# Altium schematic sheet PWR_SUPPLY.SchDoc
size A4; SheetNumber: 3; SheetTotal: 6
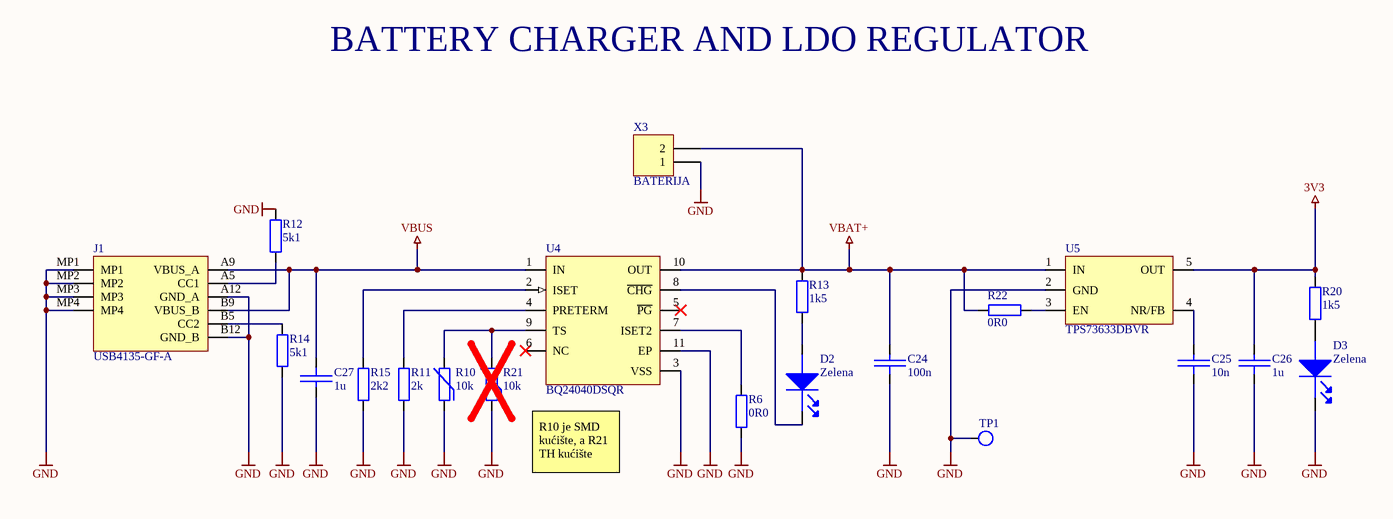
[diagram p0: PWR_SUPPLY.SchDoc]

## Parts
C24  100n  [0805]
C25  10n  [0805]
C26  1u  [0603]
C27  1u  [0603]
D2  Zelena  [0805]
D3  Zelena  [0805]
J1  USB4135-GF-A  [USB4135GFA]
R6  0R0  [0603]
R10  10k  [0402]
R11  2k  [0805]
R12  5k1  [0603]
R13  1k5  [0805]
R14  5k1  [0603]
R15  2k2  [0805]
R20  1k5  [0805]
R21  10k  [TH NTC]
R22  0R0  [0603]
TP1  TEST_POINT  [TST_POINT]  (value not drawn)  (no BOM)
U4  BQ24040DSQR  [WSON-10]
U5  TPS73633DBVR  [SOT23 5pin]
X3  BATERIJA  [BATTERY]  (no BOM)

## Nets
3V3: C26.2 R20.2 U5.5(OUT)
GND: C24.1 C25.1 C26.1 C27.2 D3.1(Cathode) J1.A12(GND_A) J1.B12(GND_B) J1.MP1 J1.MP2 J1.MP3 J1.MP4 R6.1 R10.1 R11.1 R12.2 R14.1 R15.1 R21.1 TP1.1 U4.3(VSS) U4.11(EP) U5.2(GND) X3.1
VBAT+: C24.2 R13.1 R22.2 U4.10(OUT) U5.1(IN) X3.2
VBUS: C27.1 J1.A9(VBUS_A) J1.B9(VBUS_B) U4.1(IN)
NetC25_2: C25.2 U5.4(NR/FB)
NetD2_1: D2.1(Cathode) U4.8(~{CHG})
NetD2_2: D2.2(Anode) R13.2
NetD3_2: D3.2(Anode) R20.1
NetJ1_A5: J1.A5(CC1) R12.1
NetJ1_B5: J1.B5(CC2) R14.2
NetR6_2: R6.2 U4.7(ISET2)
NetR10_2: R10.2 R21.2 U4.9(TS)
NetR11_2: R11.2 U4.4(PRETERM)
NetR15_2: R15.2 U4.2(ISET)
NetR22_1: R22.1 U5.3(EN)

Not connected (* = marked no-connect by the designer): U4 5(~{PG})* 6(NC)*

## Notes on the sheet
- BATTERY CHARGER AND LDO REGULATOR
- R10 je SMD kućište, a R21 TH kućište

## Library data of the parts
C24 = MCJCU21GBB7104KTPA01: Kondenzator, X7R, 10%, 50VDC; Manufacturer: TDK; Manufacturer Part Number: C2012X7R1H104K125AE; Capacitance: 100nF; Value: 100nF; Supplier 1: Mouser; Case/Package: 0805; ComponentLink1Description: https://datasheet.ciiva.com/29534/mlcc-commercial-soft-en-29534235.pdf?src-supplier=Digi-Key; Supplier Part Number 1: 963-MCJCU21GBB7104KT; Category: Ceramic Capacitors; Supplier 2: Mouser; Supplier Part Number 2: 810-C2012X7R1H104KAE; Kučište: 0805
C25 = C0805C103K5RECAUTO: Kondenzator, C0G, 10%, 50VDC; Manufacturer: KEMET; Capacitance: 10nF; Value: 10nF; Supplier 1: Mouser; Manufacturer Part Number: C0805C103K5RECAUTO; Case/Package: 0805; ComponentLink1Description: http://www.farnell.com/datasheets/2723804.pdf?src-supplier=Farnell; Supplier Part Number 1: 80-C0805C103K5RECAUT; Category: Ceramic Capacitors; Kučište: 0805
C26 C27 = C1608X7R1H105K080AB: Kondenzator, X7R, 10%, 50VDC; Manufacturer: TDK; Value: 1µF; Dielectric Material: Ceramic; Voltage Rating (DC): 50V; Supplier: DigiKey; Supplier Part Number: 445-C1608X7R1H105K080ABCT-ND; Manufacturer Part Number: C1608X7R1H105K080AB; Category: Ceramic Capacitors; Stock: 9450; Pricing: 1=0.21, 10=0.121, 50=0.0866, 100=0.076, 500=0.05824, 1000=0.05277 (USD); Height: 800µm; Length: 1.6mm; Lifecycle Status: Production; Max Operating Temperature: 125°C; Min Operating Temperature: -55°C; Mounting Technology: Surface Mount; Number of Terminals: 2; Width: 800µm; ComponentLink1URL: https://datasheet.octopart.com:443/C1608X7R1H105K080AB-TDK-datasheet-175423548.pdf?src-supplier=IHS; ComponentLink1Description: https://datasheet.octopart.com:443/C1608X7R1H105K080AB-TDK-datasheet-175423548.pdf?src-supplier=IHS; Kučište: 0603; Case/Package: 0603
D2 D3 = SM0805GCL: Dioda, svjetleća, 1,9V; Manufacturer: Bivar; Supplier 1: Mouser; Manufacturer Part Number: SM0805GCL; Category: LEDs; Case/Package: 0805; ComponentLink1Description: https://datasheet.ciiva.com/16487/sm0805gcl-16487554.pdf?src-supplier=Future+Electronics; Supplier Part Number 1: 749-SM0805GCL; Kučište: 0805
J1 = USB4135-GF-A: USB-C priključak; Manufacturer_Name: GCT (GLOBAL CONNECTOR TECHNOLOGY); Geometry.Height: 3.5mm; Manufacturer_Part_Number: USB4135-GF-A; Mouser Part Number: 640-USB4135-GF-A; Mouser Price/Stock: https://www.mouser.co.uk/ProductDetail/GCT/USB4135-GF-A?qs=Li%252BoUPsLEnt6HRo6RUvaXA%3D%3D; Arrow Part Number: *; Arrow Price/Stock: *; Datasheet Link: https://ar.mouser.com/datasheet/2/837/usb4135-2930399.pdf; Supplier 1: Farnell; Supplier Part Number 1: 3946920; Case/Package: SMD-10, 11,14x6,78mm
R6 R22 = CRCW06030000Z0EA: Otpornik, 1%, 100mW; Kučište: 0402; Supplier 1: Farnell; Supplier Part Number 1: MCMR04X000 PTL
  R6: Case/Package: 0402
  R22: Case/Package: 0603
R10 = NTCG103JF103FT1: NTC Termistor, 1%; Kučište: 0402; Supplier 1: Farnell; Supplier Part Number 1: NTCG103JF103FT1S; Case/Package: 0402
R11 = RC0805FR-102KL: Otpornik, 1%, 125mW; Manufacturer: Yageo; Supplier 1: Mouser; Manufacturer Part Number: RC0805FR-102KL; Supplier Part Number 1: 603-RC0805FR-102KL; Category: Resistors; Kučište: 0805; Case/Package: 0805
R12 R14 = MCT06030C5101FPW00: Otpornik, ±100ppm/C, 100mW; Manufacturer: Yageo Group; Manufacturer Part Number: AC0603FR-075K1L; Value: 5.1kΩ; Temperature Coefficient: 100ppm/°C; Tolerance: 1%; Voltage Rating: 75V; Supplier: RS; Supplier Part Number: 1978087; RoHS: Compliant; Category: Chip SMD Resistors; Stock: 3500; Pricing: 500=0.005, 2500=0.005, 5000=0.004, 7500=0.004, 10000=0.004 (GBP); Case/Package: 0603; Case Code (Imperial): 0603; Case Code (Metric): 1608; China RoHS: Non-Compliant; Composition: Thick Film; Features: Automotive AEC-Q200, Moisture Resistant; Height: 450µm; Length: 1.6mm; Lifecycle Status: Production; Max Operating Temperature: 155°C; Max Power Dissipation: 100mW; Min Operating Temperature: -55°C; Mounting Technology: Surface Mount; Number of Terminals: 2; Number of Terminations: 2; Packaging: Tape & Reel; Power Dissipation: 100mW; Power Rating: 100mW; REACH SVHC: Yes; Schedule B: 8533210045, 8533210045|8533210045|8533210045|8533210045|8533210045|8533210045|8533210045|8533210045|8533210045|8533210045|8533210045|8533210045|8533210045|8533210045|8533210045|8533210045|8533210045|8533210045|8533210045|8533210045|8533210045|8533210045|8533210045|85; Termination: SMD/SMT; Weight: 2.012816mg; Width: 800µm; Working Voltage: 75V; ComponentLink1URL: https://datasheet.octopart.com:443/AC0603FR-075K1L-Yageo-datasheet-182189377.pdf?src-supplier=IHS; ComponentLink1Description: https://datasheet.octopart.com:443/AC0603FR-075K1L-Yageo-datasheet-182189377.pdf?src-supplier=IHS; ComponentLink2URL: https://datasheet.octopart.com:443/AC0603FR-075K1L-Yageo-datasheet-86786639.pdf?src-supplier=Upverter; ComponentLink2Description: https://datasheet.octopart.com:443/AC0603FR-075K1L-Yageo-datasheet-86786639.pdf?src-supplier=Upverter; ComponentLink3URL: https://datasheet.octopart.com:443/AC0603FR-075K1L-Yageo-datasheet-178509465.pdf?src-supplier=Newark; ComponentLink3Description: https://datasheet.octopart.com:443/AC0603FR-075K1L-Yageo-datasheet-178509465.pdf?src-supplier=Newark; ComponentLink4URL: https://datasheet.octopart.com:443/AC0603FR-075K1L-Yageo-datasheet-151884373.pdf?src-supplier=Future+Electronics; ComponentLink4Description: https://datasheet.octopart.com:443/AC0603FR-075K1L-Yageo-datasheet-151884373.pdf?src-supplier=Future+Electronics; ComponentLink5URL: https://datasheet.octopart.com:443/AC0603FR-075K1L-Yageo-datasheet-166720450.pdf?src-supplier=Future+Electronics; ComponentLink5Description: https://datasheet.octopart.com:443/AC0603FR-075K1L-Yageo-datasheet-166720450.pdf?src-supplier=Future+Electronics; ComponentLink6URL: https://datasheet.octopart.com:443/AC0603FR-075K1L-Yageo-datasheet-137699919.pdf?src-supplier=Future+Electronics; ComponentLink6Description: https://datasheet.octopart.com:443/AC0603FR-075K1L-Yageo-datasheet-137699919.pdf?src-supplier=Future+Electronics; ComponentLink7URL: https://datasheet.octopart.com:443/AC0603FR-075K1L-Yageo-datasheet-128679721.pdf?src-supplier=X-ON; ComponentLink7Description: https://datasheet.octopart.com:443/AC0603FR-075K1L-Yageo-datasheet-128679721.pdf?src-supplier=X-ON; ComponentLink8URL: https://datasheet.octopart.com/AC0603FR-075K1L-Yageo-datasheet-12512238.pdf; ComponentLink8Description: https://datasheet.octopart.com/AC0603FR-075K1L-Yageo-datasheet-12512238.pdf; ComponentLink9URL: https://datasheet.octopart.com:443/AC0603FR-075K1L-Yageo-Group-datasheet-190301926.pdf?src-supplier=element14+APAC; ComponentLink9Description: https://datasheet.octopart.com:443/AC0603FR-075K1L-Yageo-Group-datasheet-190301926.pdf?src-supplier=element14+APAC; ComponentLink10URL: http://sigma.octopart.com:80/conflict_mineral_statement/Yageo-company-3.pdf?src-supplier=Compliance+Statements; ComponentLink10Description: http://sigma.octopart.com:80/conflict_mineral_statement/Yageo-company-3.pdf?src-supplier=Compliance+Statements; ComponentLink11URL: http://sigma.octopart.com:80/rohs_statement/Yageo-company-2.pdf?src-supplier=Compliance+Statements; ComponentLink11Description: http://sigma.octopart.com:80/rohs_statement/Yageo-company-2.pdf?src-supplier=Compliance+Statements; Supplier 1: RS; Supplier Part Number 1: 1978087; Kučište: 0603
R13 R20 = MCU08050C1501FP5: Otpornik, ±50ppm/C, 100mW; ComponentLink5URL: https://datasheet.octopart.com:443/CRCW12061K50JNEA-Vishay-datasheet-21226360.pdf?src-supplier=Newark; ComponentLink5Description: https://datasheet.octopart.com:443/CRCW12061K50JNEA-Vishay-datasheet-21226360.pdf?src-supplier=Newark; ComponentLink8URL: https://datasheet.octopart.com:443/CRCW12061K50JNEA-Vishay-datasheet-24897302.pdf?src-supplier=Farnell; ComponentLink8Description: https://datasheet.octopart.com:443/CRCW12061K50JNEA-Vishay-datasheet-24897302.pdf?src-supplier=Farnell; ComponentLink9URL: https://datasheet.octopart.com:443/CRCW12061K50JNEA-Vishay-datasheet-62316122.pdf?src-supplier=Future+Electronics; ComponentLink9Description: https://datasheet.octopart.com:443/CRCW12061K50JNEA-Vishay-datasheet-62316122.pdf?src-supplier=Future+Electronics; ComponentLink10URL: https://datasheet.octopart.com:443/CRCW12061K50JNEA-Vishay-datasheet-5300368.pdf?src-supplier=Future+Electronics; ComponentLink10Description: https://datasheet.octopart.com:443/CRCW12061K50JNEA-Vishay-datasheet-5300368.pdf?src-supplier=Future+Electronics; ComponentLink11URL: https://datasheet.octopart.com:443/CRCW12061K50JNEA-Vishay-datasheet-137115460.pdf?src-supplier=X-ON; ComponentLink11Description: https://datasheet.octopart.com:443/CRCW12061K50JNEA-Vishay-datasheet-137115460.pdf?src-supplier=X-ON; ComponentLink12URL: https://datasheet.octopart.com:443/CRCW12061K50JNEA-Vishay-Dale-datasheet-47688880.pdf?src-supplier=RS+(Formerly+Allied+Electronics); ComponentLink12Description: https://datasheet.octopart.com:443/CRCW12061K50JNEA-Vishay-Dale-datasheet-47688880.pdf?src-supplier=RS+(Formerly+Allied+Electronics); ComponentLink13URL: https://datasheet.octopart.com:443/CRCW12061K50JNEA-Vishay-datasheet-12001583.pdf?src-supplier=RS+(Formerly+Allied+Electronics); ComponentLink13Description: https://datasheet.octopart.com:443/CRCW12061K50JNEA-Vishay-datasheet-12001583.pdf?src-supplier=RS+(Formerly+Allied+Electronics); ComponentLink14URL: https://datasheet.octopart.com:443/CRCW12061K50JNEA-Vishay-datasheet-5306405.pdf?src-supplier=RS+(Formerly+Allied+Electronics); ComponentLink14Description: https://datasheet.octopart.com:443/CRCW12061K50JNEA-Vishay-datasheet-5306405.pdf?src-supplier=RS+(Formerly+Allied+Electronics); ComponentLink15URL: https://datasheet.octopart.com:443/CRCW12061K50JNEA-Vishay-datasheet-11540273.pdf?src-supplier=Arrow+Electronics; ComponentLink15Description: https://datasheet.octopart.com:443/CRCW12061K50JNEA-Vishay-datasheet-11540273.pdf?src-supplier=Arrow+Electronics; ComponentLink16URL: https://datasheet.octopart.com:443/CRCW12061K50JNEA-Vishay-datasheet-8445837.pdf?src-supplier=element14; ComponentLink16Description: https://datasheet.octopart.com:443/CRCW12061K50JNEA-Vishay-datasheet-8445837.pdf?src-supplier=element14; ComponentLink17URL: https://datasheet.octopart.com:443/CRCW12061K50JNEA-Vishay-datasheet-5377184.pdf?src-supplier=Garrett; ComponentLink17Description: https://datasheet.octopart.com:443/CRCW12061K50JNEA-Vishay-datasheet-5377184.pdf?src-supplier=Garrett; ComponentLink18URL: https://datasheet.octopart.com:443/CRCW12061K50JNEA-Vishay-datasheet-148188.pdf?src-supplier=Garrett; ComponentLink18Description: https://datasheet.octopart.com:443/CRCW12061K50JNEA-Vishay-datasheet-148188.pdf?src-supplier=Garrett; ComponentLink19URL: https://datasheet.octopart.com:443/CRCW12061K50JNEA-Vishay-datasheet-41916.pdf?src-supplier=Garrett; ComponentLink19Description: https://datasheet.octopart.com:443/CRCW12061K50JNEA-Vishay-datasheet-41916.pdf?src-supplier=Garrett; ComponentLink20URL: http://sigma.octopart.com:80/rohs_statement/Vishay-company-15.pdf?src-supplier=Compliance+Statements; ComponentLink20Description: http://sigma.octopart.com:80/rohs_statement/Vishay-company-15.pdf?src-supplier=Compliance+Statements; Supplier 1: Farnell; Supplier Part Number 1: MCU08050C1501FP500; Parameter 1: *; Kučište: 0805; Case/Package: 0805
R15 = MCU08050C2201FP5: Otpornik, ±100ppm/C, 125mW; Manufacturer: Panasonic; Manufacturer Part Number: ERJ-PB6B2201V; Manufacturer Lifecycle Status: ACTIVE; Part Series: High Precision Thick Film Chip Resistors; Max Power Dissipation: 250mW; Value: 2.2kΩ; Temperature Coefficient: 50ppm/°C; Tolerance: 0.1%; Voltage Rating (DC): 150V; Supplier: Farnell; Supplier Part Number: 4541375; RoHS: Compliant; Category: Chip SMD Resistors; Stock: 4030; Pricing: 10=0.0861, 100=0.0757, 500=0.0585, 1000=0.0534, 2500=0.0478, 5000=0.0422 (GBP); Case/Package: 0805; Case Code (Imperial): 0805; Case Code (Metric): 2012; Composition: Thick Film; Country of Origin: Japan; Export Control Classification Number (ECCN) Code: EAR99; Features: Automotive AEC-Q200; Height: 600µm; Height - Seated (Max): 711.2µm; Harmonized Tariff Schedule (HTS) Code: 8533.21.00.30; Introduction Date: 2016-02-25; Length: 2mm; Lifecycle Status: Production; Max Operating Temperature: 155°C; Min Operating Temperature: -55°C; Mounting Technology: Surface Mount; Number of Terminals: 2; Number of Terminations: 2; Power Dissipation: 250mW; Power Rating: 250mW; REACH SVHC: Yes; Schedule B: 8533210045, 8533210045|8533210045|8533210045|8533210045|8533210045; Width: 1.25mm; Working Voltage: 150V; ComponentLink1URL: https://datasheet.octopart.com:443/ERJ-PB6B2201V-Panasonic-datasheet-82522998.pdf?src-supplier=Panasonic; ComponentLink1Description: https://datasheet.octopart.com:443/ERJ-PB6B2201V-Panasonic-datasheet-82522998.pdf?src-supplier=Panasonic; ComponentLink2URL: https://datasheet.octopart.com:443/ERJPB6B2201V-Panasonic-datasheet-176289525.pdf?src-supplier=TME; ComponentLink2Description: https://datasheet.octopart.com:443/ERJPB6B2201V-Panasonic-datasheet-176289525.pdf?src-supplier=TME; ComponentLink3URL: https://sigma.octopart.com:443/150570796/technical_drawing/Panasonic-ERJPB6B2201V.pdf?src-supplier=Panasonic+SCT; ComponentLink3Description: https://sigma.octopart.com:443/150570796/technical_drawing/Panasonic-ERJPB6B2201V.pdf?src-supplier=Panasonic+SCT; ComponentLink4URL: https://datasheet.octopart.com:443/ERJPB6B2201V-Panasonic-datasheet-177212511.pdf?src-supplier=Burklin+Elektronik; ComponentLink4Description: https://datasheet.octopart.com:443/ERJPB6B2201V-Panasonic-datasheet-177212511.pdf?src-supplier=Burklin+Elektronik; Supplier 1: Farnell; Supplier Part Number 1: 4541375; Supplier 2: Farnell; Supplier Part Number 2: MCU08050C2201FP500; Kučište: 0805
R21 = 954-103AT-2: NTC Termistor, 1%; Supplier 1: DigiKey; Supplier Part Number 1: 4316-103AT-2-ND; Case/Package: TH-2, 3,7x2,54 mm
U4 = BQ24040DSQR: Li-Ion baterija, 800mA; Manufacturer_Name: Texas Instruments; Datasheet Link: http://www.ti.com/lit/gpn/bq24040; Height: 0.8mm; Manufacturer_Part_Number: BQ24040DSQR; Mouser Part Number: 595-BQ24040DSQR; Mouser Price/Stock: https://www.mouser.co.uk/ProductDetail/Texas-Instruments/BQ24040DSQR?qs=c7TMWs5treTJYvOlVMq%252B%2Fw%3D%3D; Arrow Part Number: BQ24040DSQR; Arrow Price/Stock: https://www.arrow.com/en/products/bq24040dsqr/texas-instruments?utm_currency=USD&region=nac; Supplier 1: Arrow Electronics; Supplier Part Number 1: BQ24040DSQR; Case/Package: WSON-10
U5 = TPS73633DBVR: IC Regulator, 3,3V, 400mADC; Manufacturer: Texas Instruments; Supplier 1: Mouser; Manufacturer Part Number: TPS73633DBVR; Category: Voltage Regulators - Linear; Case/Package: SOT-23; ComponentLink1Description: https://datasheet.ciiva.com/41462/001015026-da-01-en-ic-reg-ldo-3-3v-0-tps73633dbvr-sot-5-tid-41462871.pdf?src-supplier=Conrad; Supplier Part Number 1: 595-TPS73633DBVR
X3 = Header 2: Header, 2-Pin; LatestRevisionDate: 17-Jul-2002; LatestRevisionNote: Re-released for DXP Platform.; Publisher: Altium Limited